# Altium schematic sheet 1-电源及加热部分.SchDoc
size A4; SheetNumber: 2; SheetTotal: 4
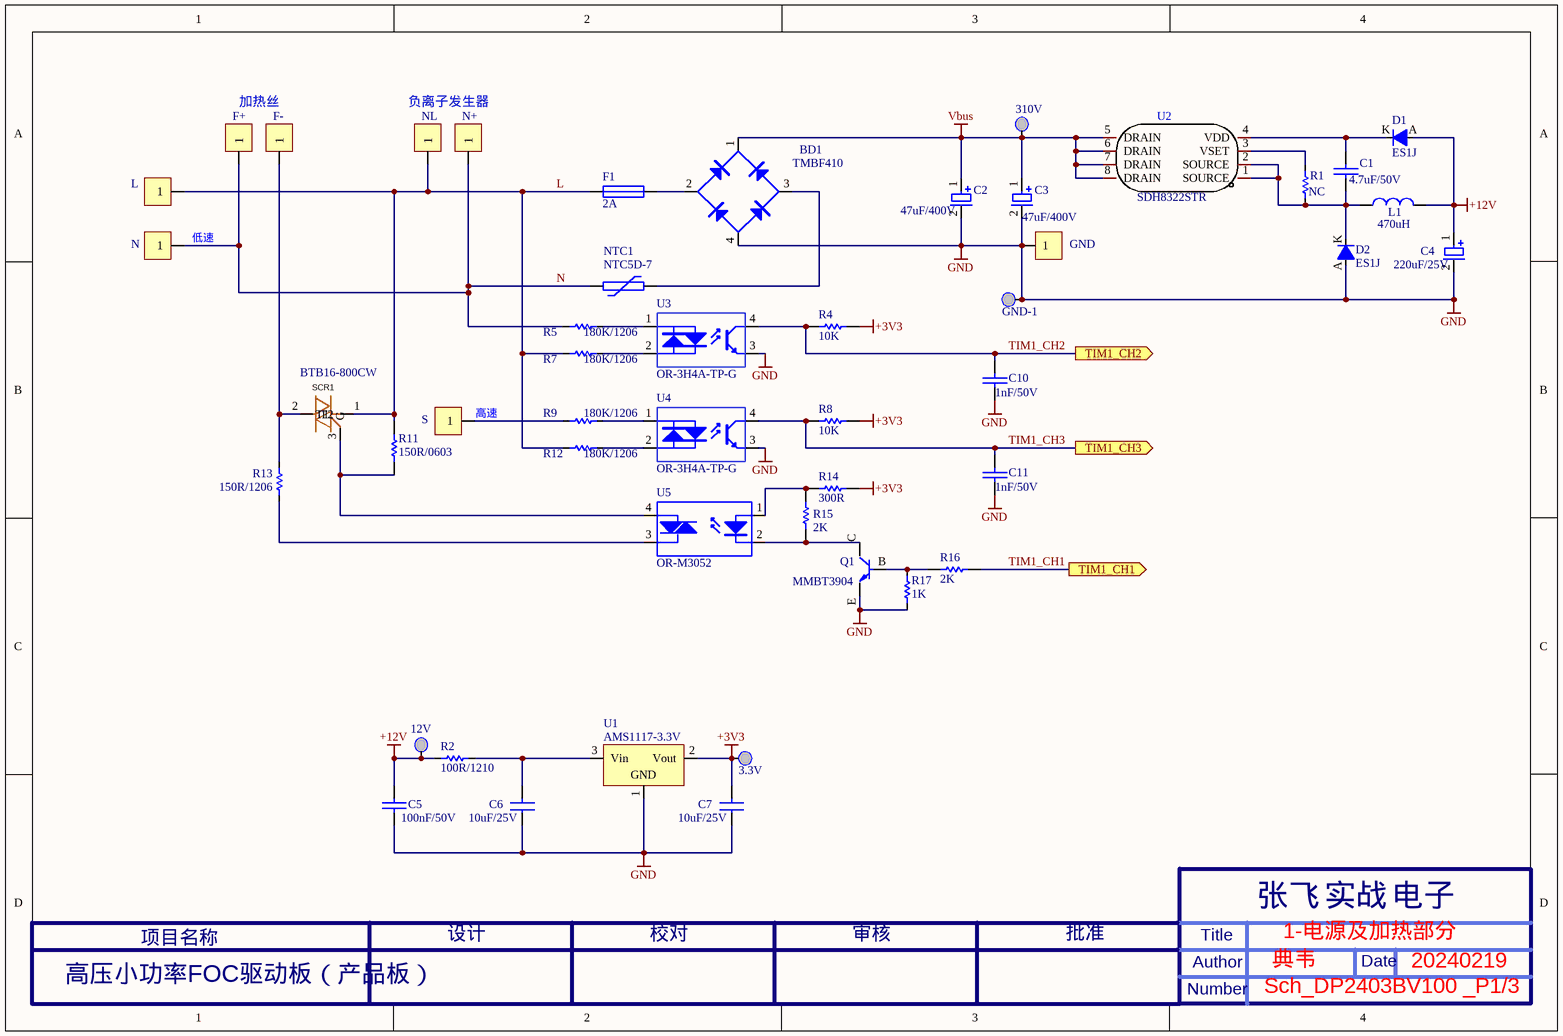
[diagram p0: 1-电源及加热部分.SchDoc]

## Parts
3.3V  test point  [Test_Port]  (value not drawn)  (no BOM)
12V  test point  [Test_Port]  (value not drawn)  (no BOM)
310V  test point  [Test_Port]  (value not drawn)  (no BOM)
BD1  TMBF410  [DBF]
C1  4.7uF/50V  [C0805]
C2  47uF/400V  [D13/L21-5]
C3  47uF/400V  [D13/L21-5]
C4  220uF/25V  [RB3.5/8.2]
C5  100nF/50V  [C0603]
C6  10uF/25V  [C0805]
C7  10uF/25V  [C0805]
C10  1nF/50V  [C0603]
C11  1nF/50V  [C0603]
D1  ES1J  [DO-214AC(SMA)]
D2  ES1J  [DO-214AC(SMA)]
F1  2A  [JFC2410-1200FS]
F+  LT  [IGBT-PIN]  (value not drawn)
F-  T1  [IGBT-PIN]  (value not drawn)
GND  GND  [IGBT-PIN]  (value not drawn)
GND-1  test point  [Test_Port]  (value not drawn)  (no BOM)
L  L  [IGBT-PIN]  (value not drawn)
L1  470uH  [L4.4/7]
N  SL  [IGBT-PIN]  (value not drawn)
N+  NA  [IGBT-PIN]  (value not drawn)
NL  LA  [IGBT-PIN]  (value not drawn)
NTC1  NTC5D-7  [NTC-5D9]
Q1  MMBT3904  [SOT-23-BCE]
R1  NC  [R1206]
R2  100R/1210  [R1210]
R4  10K  [R0603]
R5  180K/1206  [R1206]
R7  180K/1206  [R1206]
R8  10K  [R0603]
R9  180K/1206  [R1206]
R11  150R/0603  [R0603]
R12  180K/1206  [R1206]
R13  150R/1206  [R1206]
R14  300R  [R0603]
R15  2K  [R0603]
R16  2K  [R0603]
R17  1K  [R0603]
S  SH  [IGBT-PIN]  (value not drawn)
SCR1  BTB16-800CW  [TO-263]
U1  AMS1117-3.3V  [SOT-223]
U2  SDH8322STR  [SOIC-8 - duplicate]
U3  OR-3H4A-TP-G  [dip4s]
U4  OR-3H4A-TP-G  [dip4s]
U5  OR-M3052  [SO-4]

## Ports
TIM1_CH1 (out, see 0-模块总图[2B]), TIM1_CH2 (out, see 0-模块总图[2B]), TIM1_CH3 (out, see 0-模块总图[2B])

## Nets
+3V3: 3.3V.1(Test) C7.2 R4.2 R8.1 R14.2 U1.2(Vout)
+12V: 12V.1(Test) C4.1 C5.1 D1.A L1.2 R2.2
GND: BD1.4 C2.2 C3.2 C4.2 C5.2 C6.1 C7.1 C10.2 C11.2 D2.A GND.1 GND-1.1(Test) Q1.E R17.2 U1.1(GND) U3.3(E) U4.3(E)
Vbus: 310V.1(Test) BD1.1 C2.1 C3.1 U2.5(DRAIN) U2.6(DRAIN) U2.7(DRAIN) U2.8(DRAIN)
L: F1.1 L.1 NL.1 R7.1 R11.2 R12.1 SCR1.1(T1)
N: F+.1 N.1 N+.1 NTC1.1 R5.1
TIM1_CH1: R16.2 ; port TIM1_CH1
TIM1_CH2: C10.1 R4.1 U3.4(C) ; port TIM1_CH2
TIM1_CH3: C11.1 R8.2 U4.4(C) ; port TIM1_CH3
NetBD1_2: BD1.2 F1.2
NetBD1_3: BD1.3 NTC1.2
NetC1_1: C1.1 D1.K U2.4(VDD)
NetC1_2: C1.2 D2.K L1.1 R1.1 U2.1(SOURCE) U2.2(SOURCE)
NetC6_2: C6.2 R2.1 U1.3(Vin)
NetF-_1: F-.1 R13.1 SCR1.2(T2)
NetQ1_B: Q1.B R16.1 R17.1
NetQ1_C: Q1.C R15.1 U5.2
NetR1_2: R1.2 U2.3(VSET)
NetR5_2: R5.2 U3.1(A)
NetR7_2: R7.2 U3.2(K)
NetR9_1: R9.1 S.1
NetR9_2: R9.2 U4.1(A)
NetR11_1: R11.1 SCR1.3(G) U5.4
NetR12_2: R12.2 U4.2(K)
NetR13_2: R13.2 U5.3
NetR14_1: R14.1 R15.2 U5.1

## Notes on the sheet
- 加热丝
- 负离子发生器
- (near N) 低速
- (near S) 高速
- 高压小功率FOC驱动板（产品板）
- 典韦
- 1-电源及加热部分
- 20240219
- Sch_DP2403BV100 _P1/3
- 张飞
- 实战
- 电子
- 项目名称
- 设计
- 校对
- 审核
- 批准
- Author
- Title
- Date
- Number

## Library data of the parts
BD1 = BRIDGE1: 贴片整流桥
C1 C5 C10 C11 = CAP: 贴片电容
C2 C3 = CAP_EC: EWH2GM680L300T,D16*L30; Part Number: *; Brand: *
C4 = CAP_EC: 电解电容; Part Number: *; Brand: *
C6 C7 = CAP NP_0: 贴片电容; Manufacturer: TDK; Dielectric: <Dielectric>; Voltage: <Voltage>; RK PN: C1005X5R0J104K050BA; Priority: A; parameter: <parameter>; Manufacturer PN: C1005X5R0J104K050BA; Created by: JJJ
D1 D2 = DIO: 二极管; 品牌: IN4007; Part Number: *; 供应商物料号: *; 规格型号: *
F1 = FUSE1: JFC2410-1200FS
F+ F- GND L N N+ NL S = Pin1: 1Pin
L1 = INDUCTOR: 电感
NTC1 = RES-NTC: 热敏电阻
Q1 = BJT-NPN: 三极管; Part Number: *; Brand: *
R1 R2 R4 R5 R7-R9 R11-R17 = Res: 电阻; Manufacturer: Generic Components; Class: Passive; SubClass: Resistor; Value: 0.125W; Published: 08/06/2000; Publisher: Altium Hobart Technology Centre; Package: 0805
SCR1 = SCR-BT136D: 可控硅; Manufacturer: FUXINSEMI(富芯森美); Name: BT136D; Add into BOM: yes; Symbol: BT136D; Device: BT136D; LCSC Part Name: BT136D-600E; Supplier Part: C842779; Manufacturer Part: BT136D; Supplier Footprint: TO-252AB(TO-252); JLCPCB Part Class: Extended Part; Datasheet: https://atta.szlcsc.com/upload/public/pdf/source/20221031/8E8EBE50990F74DEDCF7AC33B64B1816.pdf; Supplier: LCSC; Convert to PCB: yes
U1 = AMS1117-3.3V: LDO; Published: *; LatestRevisionDate: *; LatestRevisionNote: *; PackageReference: *; Publisher: *; Code_JEDEC: *
U2 = SDH8322STR: Manufacturer: SILAN(士兰微); Add into BOM: yes; Name: SDH8322STR; Symbol: SDH8322STR; Device: SDH8322STR; LCSC Part Name: SDH8322STR; Supplier Part: C601603; Manufacturer Part: SDH8322STR; Supplier Footprint: SOP-8; JLCPCB Part Class: Extended Part; Datasheet: https://atta.szlcsc.com/upload/public/pdf/source/20220114/47A40E3BFCF876A2A0FC3F5058555B84.pdf; Supplier: LCSC; Convert to PCB: yes
U3 U4 = LTV-354T
U5 = ORM305x
3.3V 12V 310V GND-1 = test point: 编号: *; 规格: *